# Altium project PCB_Project.PrjPcb
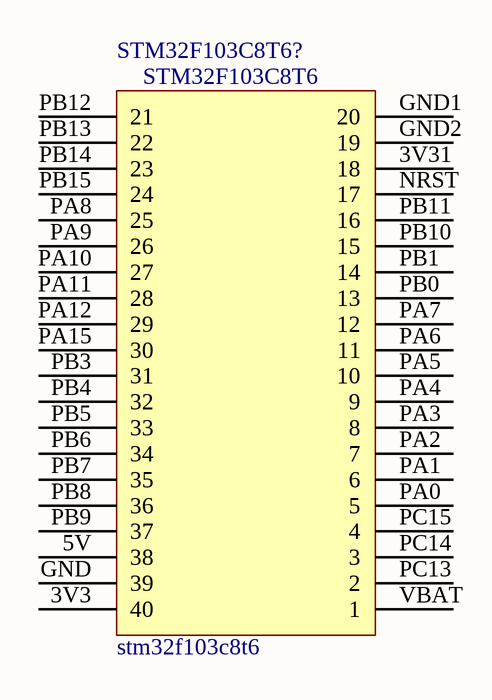
[diagram p0: Sheet1.SchDoc]
1 sheet, 1 parts. Net scope: global (net labels, ports and power ports of the same name join across sheets).

## Sheet Sheet1.SchDoc
size A; SheetNumber: 1; SheetTotal: 1

### Parts
STM32F103C8T6?  stm32f103c8t6  [STM32F103]

### Nets

Not connected (* = marked no-connect by the designer): STM32F103C8T6? 3V3(40) 3V31(18) 5V(38) GND(39) GND1(20) GND2(19) NRST(17) PA0(5) PA1(6) PA2(7) PA3(8) PA4(9) PA5(10) PA6(11) PA7(12) PA8(25) PA9(26) PA10(27) PA11(28) PA12(29) PA15(30) PB0(13) PB1(14) PB3(31) PB4(32) PB5(33) PB6(34) PB7(35) PB8(36) PB9(37) PB10(15) PB11(16) PB12(21) PB13(22) PB14(23) PB15(24) PC13(2) PC14(3) PC15(4) VBAT(1)

### Notes on the sheet
- (in symbol STM32F103) STM32F103C8T6

### Library data of the parts
STM32F103C8T6? = STM32F103